# Altium schematic sheet ethernet.SchDoc: Ethernet (Xport Pro)
size A4; Organization: UNSW Solar Racing Team; Address3: UNSW; Address4: Sydney NSW 2052; Address2: Electrical Engineering; Address1: Room 342
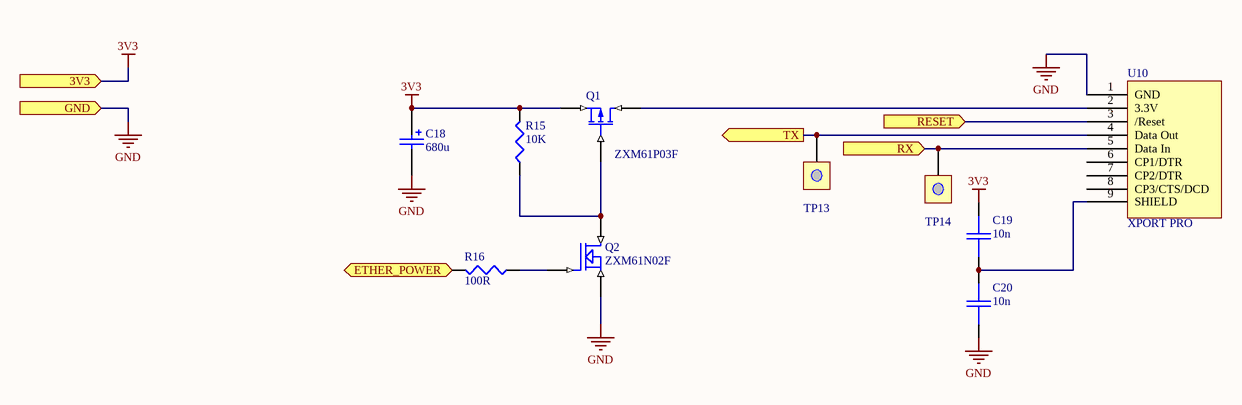
[diagram p0: ethernet.SchDoc]

## Parts
C18  680u  [MCCT-CASED]
C19  10n  [0805]
C20  10n  [0805]
Q1  ZXM61P03F  [SOT23-3]
Q2  ZXM61N02F  [SOT23-3]
R15  10K  [0603]
R16  100R  [0603]
TP13  TEST  [TESTPOINT]  (value not drawn)
TP14  TEST  [TESTPOINT]  (value not drawn)
U10  XPORT PRO  [XPORT PRO]

## Ports
3V3 (in), ETHER_POWER (in), GND (in), RESET (in), RX (in), TX (out)

## Nets
3V3: C18.1 C19.1 Q1.3(D) R15.2 ; port 3V3
GND: C18.2 C20.2 Q2.2(S) U10.1(GND) ; port GND
ETHER_POWER: R16.2 ; port ETHER_POWER
RESET: U10.3(/Reset) ; port RESET
RX: TP14.0(TP) U10.5(Data_In) ; port RX
TX: TP13.0(TP) U10.4(Data_Out) ; port TX
NetC19_2: C19.2 C20.1 U10.9(SHIELD)
NetQ1_1: Q1.1(G) Q2.3(D) R15.1
NetQ1_2: Q1.2(S) U10.2(3.3V)
NetQ2_1: Q2.1(G) R16.1

Not connected (* = marked no-connect by the designer): U10 6(CP1/DTR) 7(CP2/DTR) 8(CP3/CTS/DCD)

## Notes on the sheet
- Title
- Size:
- Date:
- A4
- Number:
- Time:
- Revision:
- Sheet
- of
- File:

## Library data of the parts
C18 = CAP POL3: Polarized Capacitor (Surface Mount); Manufacturer: Generic Components; Class I: Passive; Value: 100pF; Published: 8-Jun-2000; Revision: July-2002: Re-released for DXP Platform.; Publisher: Altium Limited; Class II: Capacitor
C19 C20 = CAP: Capacitor; Farnell: 1737277; FarnellPrice: 0.57
Q1 = ZXM61P03F: 1.1A, 30V P-Channel Enhancement mode FET
Q2 = ZXM61N02F: 1.7A, 20V N-Channel Enhancement mode FET
R15 R16 = RES1: Resistor
TP13 TP14 = TEST: TEST POINT
U10 = Xport Pro: Lantronix Xport Pro